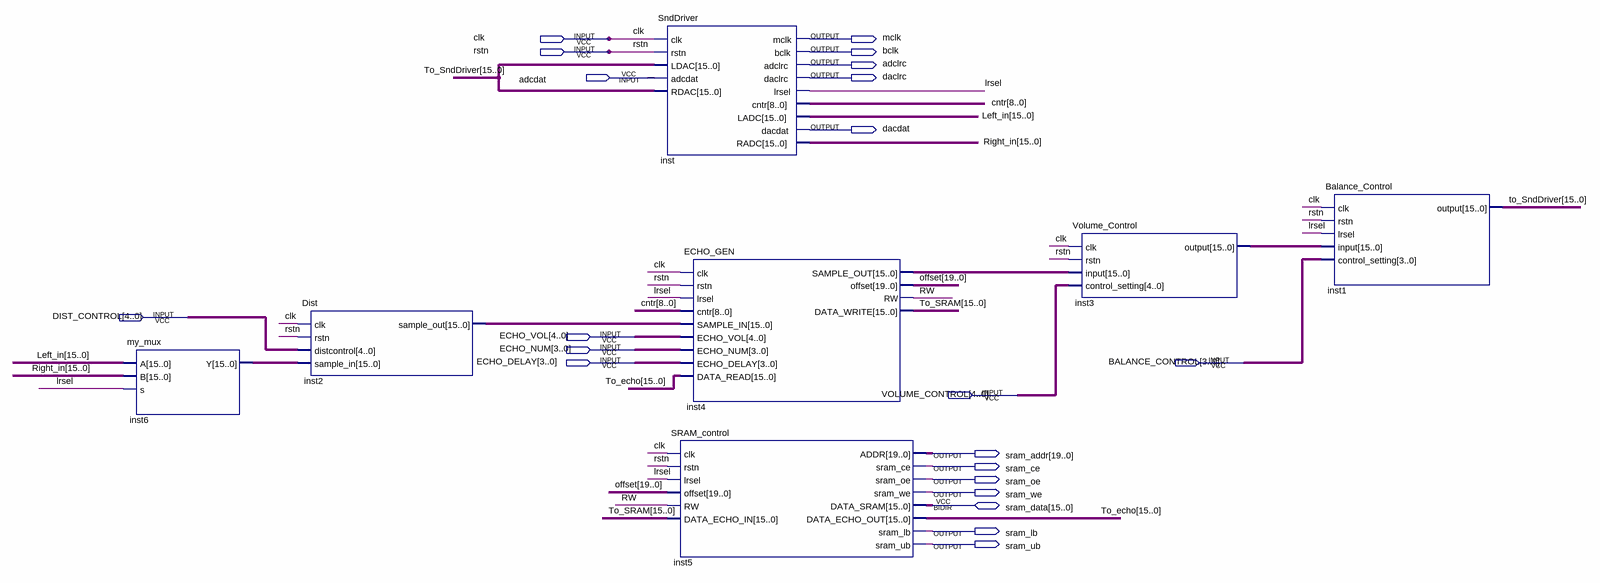
[diagram p0: schematic sheet]
// Quartus schematic BIG_SOUND_BLOCK.bdf as structural Verilog: 7 symbols, 21 pins
module BIG_SOUND_BLOCK (
  input  clk,
  input  rstn,
  input  adcdat,
  input  [4:0] DIST_CONTROL,
  input  [4:0] ECHO_VOL,
  input  [3:0] ECHO_NUM,
  input  [3:0] ECHO_DELAY,
  input  [3:0] BALANCE_CONTROL,
  input  [4:0] VOLUME_CONTROL,
  inout  [15:0] sram_data,
  output mclk,
  output bclk,
  output adclrc,
  output daclrc,
  output dacdat,
  output [19:0] sram_addr,
  output sram_ce,
  output sram_oe,
  output sram_we,
  output sram_lb,
  output sram_ub
);

  wire lrsel, RW;
  wire [8:0] cntr;
  wire [15:0] inst2_sample_out, inst3_output, inst4_sample_out, inst6_y, Left_in, Right_in, To_echo,
       to_SndDriver, To_SRAM;
  wire [19:0] offset;

  my_mux inst6 (.A(Left_in), .B(Right_in), .s(lrsel), .Y(inst6_y));
  Dist inst2 (.clk(clk), .rstn(rstn), .distcontrol(DIST_CONTROL), .sample_in(inst6_y), .sample_out(inst2_sample_out));
  SndDriver inst (
    .clk(clk), .rstn(rstn), .LDAC(to_SndDriver), .adcdat(adcdat), .RDAC(to_SndDriver), .mclk(mclk),
    .bclk(bclk), .adclrc(adclrc), .daclrc(daclrc), .lrsel(lrsel), .cntr(cntr), .LADC(Left_in),
    .dacdat(dacdat), .RADC(Right_in));
  ECHO_GEN inst4 (
    .clk(clk), .rstn(rstn), .lrsel(lrsel), .cntr(cntr), .SAMPLE_IN(inst2_sample_out), .ECHO_VOL(ECHO_VOL),
    .ECHO_NUM(ECHO_NUM), .ECHO_DELAY(ECHO_DELAY), .DATA_READ(To_echo), .SAMPLE_OUT(inst4_sample_out),
    .offset(offset), .RW(RW), .DATA_WRITE(To_SRAM));
  SRAM_control inst5 (
    .clk(clk), .rstn(rstn), .lrsel(lrsel), .offset(offset), .RW(RW), .DATA_ECHO_IN(To_SRAM),
    .ADDR(sram_addr), .sram_ce(sram_ce), .sram_oe(sram_oe), .sram_we(sram_we), .DATA_ECHO_OUT(To_echo),
    .sram_lb(sram_lb), .sram_ub(sram_ub), .DATA_SRAM(sram_data));
  Volume_Control inst3 (
    .clk(clk), .rstn(rstn), .\input (inst4_sample_out), .control_setting(VOLUME_CONTROL),
    .\output (inst3_output));
  Balance_Control inst1 (
    .clk(clk), .rstn(rstn), .lrsel(lrsel), .\input (inst3_output), .control_setting(BALANCE_CONTROL),
    .\output (to_SndDriver));
endmodule
